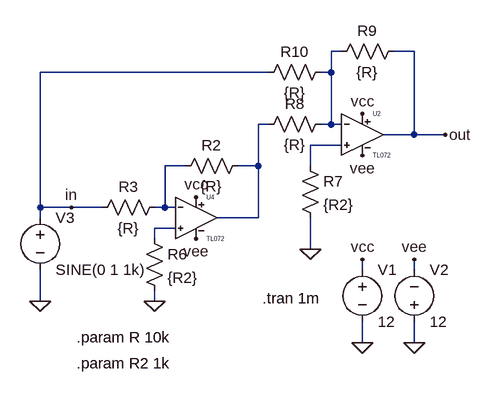
[diagram p0: schematic restador_ajustable.asc]
restador_ajustable.asc, the LTspice schematic file:
Version 4
SHEET 1 936 680
WIRE 720 64 704 64
WIRE 832 64 800 64
WIRE 608 96 256 96
WIRE 704 96 704 64
WIRE 704 96 688 96
WIRE 608 176 592 176
WIRE 704 176 704 96
WIRE 704 176 688 176
WIRE 720 176 704 176
WIRE 832 192 832 64
WIRE 832 192 784 192
WIRE 880 192 832 192
WIRE 720 208 672 208
WIRE 480 240 448 240
WIRE 592 240 592 176
WIRE 592 240 560 240
WIRE 672 240 672 208
WIRE 256 304 256 96
WIRE 304 304 256 304
WIRE 352 304 304 304
WIRE 448 304 448 240
WIRE 448 304 432 304
WIRE 464 304 448 304
WIRE 256 320 256 304
WIRE 592 320 592 240
WIRE 592 320 528 320
WIRE 464 336 432 336
WIRE 432 352 432 336
WIRE 672 368 672 320
WIRE 752 400 752 384
WIRE 832 400 832 384
WIRE 256 448 256 400
WIRE 432 448 432 432
WIRE 752 512 752 480
WIRE 832 512 832 480
FLAG 752 512 0
FLAG 832 512 0
FLAG 752 384 vcc
FLAG 832 384 vee
FLAG 752 160 vcc
FLAG 752 224 vee
FLAG 496 288 vcc
FLAG 496 352 vee
FLAG 672 368 0
FLAG 432 448 0
FLAG 256 448 0
FLAG 880 192 out
FLAG 304 304 in
SYMBOL voltage 752 384 R0
SYMATTR InstName V1
SYMATTR Value 12
SYMBOL voltage 832 496 M180
WINDOW 0 24 96 Left 2
WINDOW 3 24 16 Left 2
SYMATTR InstName V2
SYMATTR Value 12
SYMBOL Opamps\\TL072 752 128 R0
SYMATTR InstName U2
SYMBOL Opamps\\TL072 496 256 R0
SYMATTR InstName U4
SYMBOL res 576 224 R90
WINDOW 0 0 56 VBottom 2
WINDOW 3 32 56 VTop 2
SYMATTR InstName R2
SYMATTR Value {R}
SYMBOL res 448 288 R90
WINDOW 0 0 56 VBottom 2
WINDOW 3 32 56 VTop 2
SYMATTR InstName R3
SYMATTR Value {R}
SYMBOL res 416 336 R0
SYMATTR InstName R6
SYMATTR Value {R2}
SYMBOL res 656 224 R0
SYMATTR InstName R7
SYMATTR Value {R2}
SYMBOL res 704 160 R90
WINDOW 0 0 56 VBottom 2
WINDOW 3 32 56 VTop 2
SYMATTR InstName R8
SYMATTR Value {R}
SYMBOL res 816 48 R90
WINDOW 0 0 56 VBottom 2
WINDOW 3 32 56 VTop 2
SYMATTR InstName R9
SYMATTR Value {R}
SYMBOL voltage 256 304 R0
WINDOW 123 0 0 Left 0
WINDOW 39 0 0 Left 0
SYMATTR InstName V3
SYMATTR Value SINE(0 1 1k)
SYMBOL res 704 80 R90
WINDOW 0 0 56 VBottom 2
WINDOW 3 32 56 VTop 2
SYMATTR InstName R10
SYMATTR Value {R}
TEXT 312 504 Left 2 !.param R 10k
TEXT 312 544 Left 2 !.param R2 1k
TEXT 598 444 Left 2 !.tran 1m

The netlist it stands for:
* restador_ajustable.asc
V1 vcc 0 12
V2 0 vee 12
XU2 N003 N001 vcc vee out TL072  ; pins In+ In- V+ V- OUT
XU4 N005 N004 vcc vee N002 TL072  ; pins In+ In- V+ V- OUT
R2 N002 N004 {R}
R3 N004 in {R}
R6 N005 0 {R2}
R7 N003 0 {R2}
R8 N001 N002 {R}
R9 out N001 {R}
V3 in 0 SINE(0 1 1k)
R10 N001 in {R}
.param R 10k
.param R2 1k
.tran 1m
.lib TL072.sub
.backanno
.end